# Altium project Palletto_PCB.PrjPcb
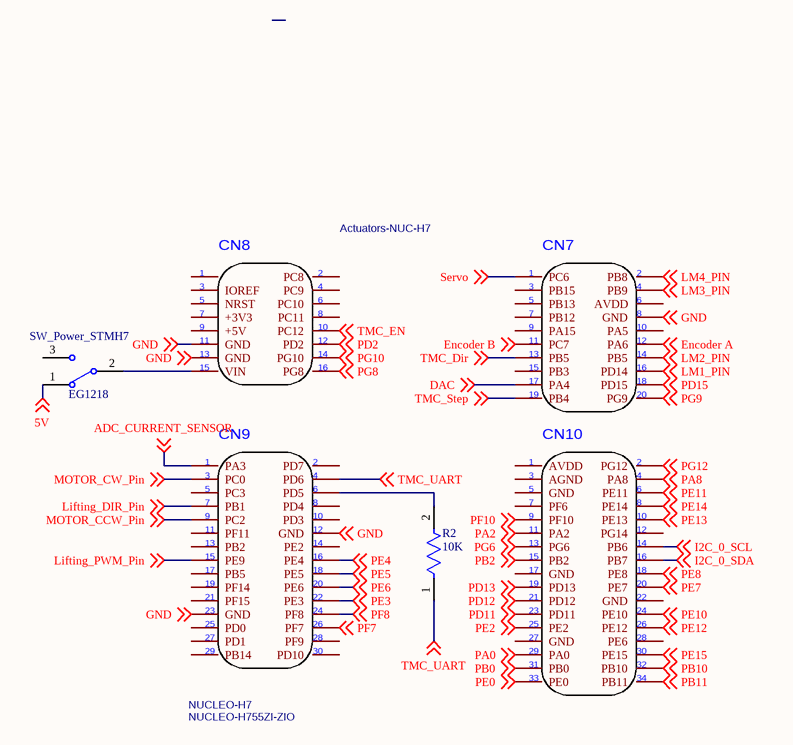
[diagram p0: STM32H755_Breakout_Schematic.SchDoc]
3 sheets, 77 parts. Net scope: flat (ports and power ports of the same name join across sheets).
Board files: Palletto_PCB.PcbDoc, Palletto_V2.PcbDoc
Sheets:
  STM32H755_Breakout_Schematic.SchDoc
  Actuators_Schematic.SchDoc
  Sensors_Schematic.SchDoc

## Sheet STM32H755_Breakout_Schematic.SchDoc
size A; SheetNumber: 1; SheetTotal: 3

### Parts
Actuators-NUC-H7  NUCLEO-H755ZI-ZIO  [NUCLEO-H7]
R2  10K  [FP-MFR-12-MFG]
SW_Power_STMH7  EG1218  [ESWI-EG1218_V]

### Nets
5V: SW_Power_STMH7.1 ; off-sheet 5V
ADC_CURRENT_SENSOR: Actuators-NUC-H7.161(PA3) ; off-sheet ADC_CURRENT_SENSOR
DAC: Actuators-NUC-H7.207(PA4) ; off-sheet DAC
Encoder A: Actuators-NUC-H7.202(PA6) ; off-sheet Encoder A
Encoder B: Actuators-NUC-H7.201(PC7) ; off-sheet Encoder B
GND: Actuators-NUC-H7.155(GND) Actuators-NUC-H7.157(GND) Actuators-NUC-H7.172(GND) Actuators-NUC-H7.183(GND) Actuators-NUC-H7.198(GND) ; off-sheet GND
I2C_0_SCL: Actuators-NUC-H7.224(PB6) ; off-sheet I2C_0_SCL
I2C_0_SDA: Actuators-NUC-H7.226(PB7) ; off-sheet I2C_0_SDA
Lifting_DIR_Pin: Actuators-NUC-H7.167(PB1) ; off-sheet Lifting_DIR_Pin
Lifting_PWM_Pin: Actuators-NUC-H7.175(PE9) ; off-sheet Lifting_PWM_Pin
LM1_PIN: Actuators-NUC-H7.206(PD14) ; off-sheet LM1_PIN
LM2_PIN: Actuators-NUC-H7.204(PB5) ; off-sheet LM2_PIN
LM3_PIN: Actuators-NUC-H7.194(PB9) ; off-sheet LM3_PIN
LM4_PIN: Actuators-NUC-H7.192(PB8) ; off-sheet LM4_PIN
MOTOR_CCW_Pin: Actuators-NUC-H7.169(PC2) ; off-sheet MOTOR_CCW_Pin
MOTOR_CW_Pin: Actuators-NUC-H7.163(PC0) ; off-sheet MOTOR_CW_Pin
PA0: Actuators-NUC-H7.239(PA0) ; off-sheet PA0
PA2: Actuators-NUC-H7.221(PA2) ; off-sheet PA2
PA8: Actuators-NUC-H7.214(PA8) ; off-sheet PA8
PB0: Actuators-NUC-H7.241(PB0) ; off-sheet PB0
PB2: Actuators-NUC-H7.225(PB2) ; off-sheet PB2
PB10: Actuators-NUC-H7.242(PB10) ; off-sheet PB10
PB11: Actuators-NUC-H7.244(PB11) ; off-sheet PB11
PD2: Actuators-NUC-H7.156(PD2) ; off-sheet PD2
PD11: Actuators-NUC-H7.233(PD11) ; off-sheet PD11
PD12: Actuators-NUC-H7.231(PD12) ; off-sheet PD12
PD13: Actuators-NUC-H7.229(PD13) ; off-sheet PD13
PD15: Actuators-NUC-H7.208(PD15) ; off-sheet PD15
PE0: Actuators-NUC-H7.243(PE0) ; off-sheet PE0
PE2: Actuators-NUC-H7.235(PE2) ; off-sheet PE2
PE3: Actuators-NUC-H7.182(PE3) ; off-sheet PE3
PE4: Actuators-NUC-H7.176(PE4) ; off-sheet PE4
PE5: Actuators-NUC-H7.178(PE5) ; off-sheet PE5
PE6: Actuators-NUC-H7.180(PE6) ; off-sheet PE6
PE7: Actuators-NUC-H7.230(PE7) ; off-sheet PE7
PE8: Actuators-NUC-H7.228(PE8) ; off-sheet PE8
PE10: Actuators-NUC-H7.234(PE10) ; off-sheet PE10
PE11: Actuators-NUC-H7.216(PE11) ; off-sheet PE11
PE12: Actuators-NUC-H7.236(PE12) ; off-sheet PE12
PE13: Actuators-NUC-H7.220(PE13) ; off-sheet PE13
PE14: Actuators-NUC-H7.218(PE14) ; off-sheet PE14
PE15: Actuators-NUC-H7.240(PE15) ; off-sheet PE15
PF7: Actuators-NUC-H7.186(PF7) ; off-sheet PF7
PF8: Actuators-NUC-H7.184(PF8) ; off-sheet PF8
PF10: Actuators-NUC-H7.219(PF10) ; off-sheet PF10
PG6: Actuators-NUC-H7.223(PG6) ; off-sheet PG6
PG8: Actuators-NUC-H7.160(PG8) ; off-sheet PG8
PG9: Actuators-NUC-H7.210(PG9) ; off-sheet PG9
PG10: Actuators-NUC-H7.158(PG10) ; off-sheet PG10
PG12: Actuators-NUC-H7.212(PG12) ; off-sheet PG12
Servo: Actuators-NUC-H7.191(PC6) ; off-sheet Servo
TMC_Dir: Actuators-NUC-H7.203(PB5) ; off-sheet TMC_Dir
TMC_EN: Actuators-NUC-H7.154(PC12) ; off-sheet TMC_EN
TMC_Step: Actuators-NUC-H7.209(PB4) ; off-sheet TMC_Step
TMC_UART: Actuators-NUC-H7.164(PD6) R2.1 ; off-sheet TMC_UART
NetActuators-NUC-H7_159: Actuators-NUC-H7.159(VIN) SW_Power_STMH7.2(COM)
NetActuators-NUC-H7_166: Actuators-NUC-H7.166(PD5) R2.2

Not connected (* = marked no-connect by the designer): Actuators-NUC-H7 145(PC10) 146(PC8) 147(IOREF) 148(PC9) 149(NRST) 150(PC10) 151(+3V3) 152(PC11) 153(+5V) 162(PD7) 165(PC3) 168(PD4) 170(PD3) 171(PF11) 173(PB2) 174(PE2) 177(PB5) 179(PF14) 181(PF15) 185(PD0) 187(PD1) 188(PF9) 189(PB14) 190(PD10) 193(PB15) 195(PB13) 196(AVDD) 197(PB12) 199(PA15) 200(PA5) 205(PB3) 211(AVDD) 213(AGND) 215(GND) 217(PF6) 222(PG14) 227(GND) 232(GND) 237(GND) 238(PE6); SW_Power_STMH7 3

### Notes on the sheet
- (in symbol NUCLEO-H755ZI-ZIO) CN8; CN7; 1; 2; 3; 4; 5; 6; 7; 8; 9; 10; 11; 12; 13; 14; 15; 16; 17; 18; 19; 20; CN9; CN10; 21; 22; 23; 24; 25; 26; 27; 28; 29; 30; 31; 32; 33; 34; NUCLEO-H7

### Library data of the parts
Actuators-NUC-H7 = NUCLEO-H755ZI-ZIO: Contributor: zutawin; Package Display: Yes; spicePre: X; Mounted: Yes; Supplier Part: 100x; Supplier: DOLI; spiceSymbolName: NUCLEO-H755ZI-ZIO
R2 = CMP-03413-000012-1: RES MF 1/6W 1% AXIAL; Power Rating: 160mW; Voltage Rating (DC): 200V; Resistance: 10kR; Min Operating Temperature: -55°C; Max Operating Temperature: 155°C; Voltage Rating: 200V; Termination: Axial; Packaging: Ammo Pack; Tolerance: 1%
SW_Power_STMH7 = CMP-1696-00002-1: Slide Switch, 500 V, -20 to 70 degC, 3-Pin THD, RoHS; Case\Package: SOT-23-5; Output Current: 150 mA; Nominal Output Voltage: 3.3 V; Max Power Dissipation: 250 mW; Min Input Voltage: 4.3 V; Outputs: 1; Max Input Voltage: 8 V; Dropout Voltage: 300 mV; PackageDescription: 3-Pin Through Hole Device, Body 11.6 x 4 mm, Pitch 2.5 mm; ComponentLink1URL: http://www.e-switch.ch/en/; RoHSCompliant: true; Length: 3 mm; ComponentLink1Description: Manufacturer URL; Power Rating: 250 mW; Mount: Surface Mount; Max Operating Temperature: 85 degC; REACH SVHC: No SVHC; Radiation Hardening: No; Height: 1.3 mm; Pins: 5; Max Ouput Current: 150 mA; Output Voltage: 3.3 V; Width: 1.8 mm; Package Quantity: 3000; ComponentLink2URL: https://www.e-switch.com/system/asset/product_line/data_sheet/119/EG.pdf; Min Operating Temperature: -40 degC; ComponentLink2Description: Datasheet; DatasheetVersion: Oct-15; PackageReference: EG1218; Packaging: Tape and Reel

## Sheet Actuators_Schematic.SchDoc
size A; SheetNumber: 2; SheetTotal: 3
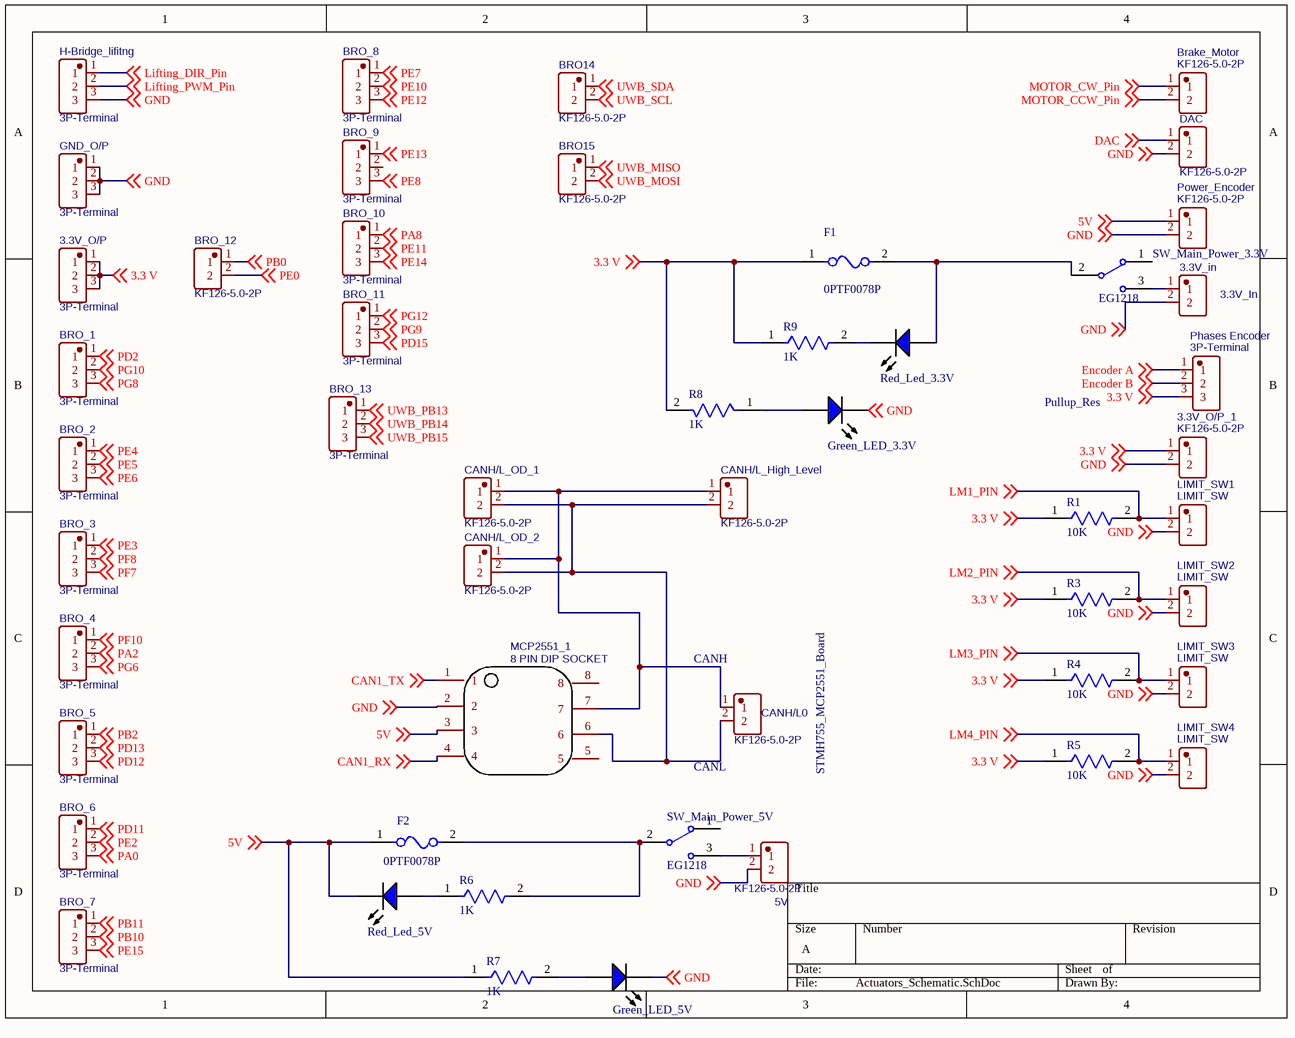
[diagram p1: Actuators_Schematic.SchDoc]

### Parts
3.3V_in  3.3V_In  [CONN-TH_P5.00_KF126-5.0-2P]
3.3V_O/P  3P-Terminal  [CONN-TH_3P-P5.00_KF126-5.0-3P]
3.3V_O/P_1  KF126-5.0-2P  [CONN-TH_P5.00_KF126-5.0-2P]
5V  KF126-5.0-2P  [CONN-TH_P5.00_KF126-5.0-2P]
Brake_Motor  KF126-5.0-2P  [CONN-TH_P5.00_KF126-5.0-2P]
BRO14  KF126-5.0-2P  [CONN-TH_P5.00_KF126-5.0-2P]
BRO15  KF126-5.0-2P  [CONN-TH_P5.00_KF126-5.0-2P]
BRO_1  3P-Terminal  [CONN-TH_3P-P5.00_KF126-5.0-3P]
BRO_2  3P-Terminal  [CONN-TH_3P-P5.00_KF126-5.0-3P]
BRO_3  3P-Terminal  [CONN-TH_3P-P5.00_KF126-5.0-3P]
BRO_4  3P-Terminal  [CONN-TH_3P-P5.00_KF126-5.0-3P]
BRO_5  3P-Terminal  [CONN-TH_3P-P5.00_KF126-5.0-3P]
BRO_6  3P-Terminal  [CONN-TH_3P-P5.00_KF126-5.0-3P]
BRO_7  3P-Terminal  [CONN-TH_3P-P5.00_KF126-5.0-3P]
BRO_8  3P-Terminal  [CONN-TH_3P-P5.00_KF126-5.0-3P]
BRO_9  3P-Terminal  [CONN-TH_3P-P5.00_KF126-5.0-3P]
BRO_10  3P-Terminal  [CONN-TH_3P-P5.00_KF126-5.0-3P]
BRO_11  3P-Terminal  [CONN-TH_3P-P5.00_KF126-5.0-3P]
BRO_12  KF126-5.0-2P  [CONN-TH_P5.00_KF126-5.0-2P]
BRO_13  3P-Terminal  [CONN-TH_3P-P5.00_KF126-5.0-3P]
CANH/L0  KF126-5.0-2P  [CONN-TH_P5.00_KF126-5.0-2P]
CANH/L_High_Level  KF126-5.0-2P  [CONN-TH_P5.00_KF126-5.0-2P]
CANH/L_OD_1  KF126-5.0-2P  [CONN-TH_P5.00_KF126-5.0-2P]
CANH/L_OD_2  KF126-5.0-2P  [CONN-TH_P5.00_KF126-5.0-2P]
DAC  KF126-5.0-2P  [CONN-TH_P5.00_KF126-5.0-2P]
F1  0PTF0078P  [FP-0PTF0078P-MFG]
F2  0PTF0078P  [FP-0PTF0078P-MFG]
GND_O/P  3P-Terminal  [CONN-TH_3P-P5.00_KF126-5.0-3P]
Green_LED_3.3V  WP710A10QBC/D  [KING-WP710A10QBCD_V]  (value not drawn)
Green_LED_5V  WP710A10QBC/D  [KING-WP710A10QBCD_V]  (value not drawn)
H-Bridge_lifitng  3P-Terminal  [CONN-TH_3P-P5.00_KF126-5.0-3P]
LIMIT_SW1  LIMIT_SW  [CONN-TH_P5.00_KF126-5.0-2P]
LIMIT_SW2  LIMIT_SW  [CONN-TH_P5.00_KF126-5.0-2P]
LIMIT_SW3  LIMIT_SW  [CONN-TH_P5.00_KF126-5.0-2P]
LIMIT_SW4  LIMIT_SW  [CONN-TH_P5.00_KF126-5.0-2P]
MCP2551_1  8 PIN DIP SOCKET  [DIP 8 PIN SOCKET]
Phases_Encoder  3P-Terminal  [CONN-TH_3P-P5.00_KF126-5.0-3P]
Power_Encoder  KF126-5.0-2P  [CONN-TH_P5.00_KF126-5.0-2P]
R1  10K  [FP-MFR-12-MFG]
R3  10K  [FP-MFR-12-MFG]
R4  10K  [FP-MFR-12-MFG]
R5  10K  [FP-MFR-12-MFG]
R6  1K  [FP-MFR-12-MFG]
R7  1K  [FP-MFR-12-MFG]
R8  1K  [FP-MFR-12-MFG]
R9  1K  [FP-MFR-12-MFG]
Red_Led_3.3V  WP710A10QBC/D  [KING-WP710A10QBCD_V]  (value not drawn)
Red_Led_5V  WP710A10QBC/D  [KING-WP710A10QBCD_V]  (value not drawn)
SW_Main_Power_3.3V  EG1218  [ESWI-EG1218_V]
SW_Main_Power_5V  EG1218  [ESWI-EG1218_V]

### Nets
3.3 V: 3.3V_O/P.1 3.3V_O/P.2 3.3V_O/P.3 3.3V_O/P_1.1 F1.1 Phases_Encoder.3 R1.1 R3.1 R4.1 R5.1 R8.2 R9.1 ; off-sheet 3.3 V
5V: F2.1 MCP2551_1.3 Power_Encoder.1 R7.1 Red_Led_5V.2(K) ; off-sheet 5V
CAN1_RX: MCP2551_1.4 ; off-sheet CAN1_RX
CAN1_TX: MCP2551_1.1 ; off-sheet CAN1_TX
DAC: DAC.1 ; off-sheet DAC
Encoder A: Phases_Encoder.1 ; off-sheet Encoder A
Encoder B: Phases_Encoder.2 ; off-sheet Encoder B
GND: 3.3V_in.2 3.3V_O/P_1.2 5V.2 DAC.2 GND_O/P.1 GND_O/P.2 GND_O/P.3 Green_LED_3.3V.2(K) Green_LED_5V.2(K) H-Bridge_lifitng.3 LIMIT_SW1.2 LIMIT_SW2.2 LIMIT_SW3.2 LIMIT_SW4.2 MCP2551_1.2 Power_Encoder.2 ; off-sheet GND
Lifting_DIR_Pin: H-Bridge_lifitng.1 ; off-sheet Lifting_DIR_Pin
Lifting_PWM_Pin: H-Bridge_lifitng.2 ; off-sheet Lifting_PWM_Pin
LM1_PIN: LIMIT_SW1.1 R1.2 ; off-sheet LM1_PIN
LM2_PIN: LIMIT_SW2.1 R3.2 ; off-sheet LM2_PIN
LM3_PIN: LIMIT_SW3.1 R4.2 ; off-sheet LM3_PIN
LM4_PIN: LIMIT_SW4.1 R5.2 ; off-sheet LM4_PIN
MOTOR_CCW_Pin: Brake_Motor.2 ; off-sheet MOTOR_CCW_Pin
MOTOR_CW_Pin: Brake_Motor.1 ; off-sheet MOTOR_CW_Pin
PA0: BRO_6.3 ; off-sheet PA0
PA2: BRO_4.2 ; off-sheet PA2
PA8: BRO_10.1 ; off-sheet PA8
PB0: BRO_12.1 ; off-sheet PB0
PB2: BRO_5.1 ; off-sheet PB2
PB10: BRO_7.2 ; off-sheet PB10
PB11: BRO_7.1 ; off-sheet PB11
PD2: BRO_1.1 ; off-sheet PD2
PD11: BRO_6.1 ; off-sheet PD11
PD12: BRO_5.3 ; off-sheet PD12
PD13: BRO_5.2 ; off-sheet PD13
PD15: BRO_11.3 ; off-sheet PD15
PE0: BRO_12.2 ; off-sheet PE0
PE2: BRO_6.2 ; off-sheet PE2
PE3: BRO_3.1 ; off-sheet PE3
PE4: BRO_2.1 ; off-sheet PE4
PE5: BRO_2.2 ; off-sheet PE5
PE6: BRO_2.3 ; off-sheet PE6
PE7: BRO_8.1 ; off-sheet PE7
PE8: BRO_9.3 ; off-sheet PE8
PE10: BRO_8.2 ; off-sheet PE10
PE11: BRO_10.2 ; off-sheet PE11
PE12: BRO_8.3 ; off-sheet PE12
PE13: BRO_9.1 ; off-sheet PE13
PE14: BRO_10.3 ; off-sheet PE14
PE15: BRO_7.3 ; off-sheet PE15
PF7: BRO_3.3 ; off-sheet PF7
PF8: BRO_3.2 ; off-sheet PF8
PF10: BRO_4.1 ; off-sheet PF10
PG6: BRO_4.3 ; off-sheet PG6
PG8: BRO_1.3 ; off-sheet PG8
PG9: BRO_11.2 ; off-sheet PG9
PG10: BRO_1.2 ; off-sheet PG10
PG12: BRO_11.1 ; off-sheet PG12
UWB_MISO: BRO15.1 ; off-sheet UWB_MISO
UWB_MOSI: BRO15.2 ; off-sheet UWB_MOSI
UWB_PB13: BRO_13.1 ; off-sheet UWB_PB13
UWB_PB14: BRO_13.2 ; off-sheet UWB_PB14
UWB_PB15: BRO_13.3 ; off-sheet UWB_PB15
UWB_SCL: BRO14.2 ; off-sheet UWB_SCL
UWB_SDA: BRO14.1 ; off-sheet UWB_SDA
Net3.3V_in_1: 3.3V_in.1 SW_Main_Power_3.3V.3
Net5V_1: 5V.1 SW_Main_Power_5V.3
NetCANH/L0_1: CANH/L0.1 CANH/L_High_Level.1 CANH/L_OD_1.1 CANH/L_OD_2.1 MCP2551_1.7
NetCANH/L0_2: CANH/L0.2 CANH/L_High_Level.2 CANH/L_OD_1.2 CANH/L_OD_2.2 MCP2551_1.6
NetF1_2: F1.2 Red_Led_3.3V.1(A) SW_Main_Power_3.3V.2(COM)
NetF2_2: F2.2 R6.2 SW_Main_Power_5V.2(COM)
NetGreen_LED_3.3V_1: Green_LED_3.3V.1(A) R8.1
NetGreen_LED_5V_1: Green_LED_5V.1(A) R7.2
NetR6_1: R6.1 Red_Led_5V.1(A)
NetR9_2: R9.2 Red_Led_3.3V.2(K)

Not connected (* = marked no-connect by the designer): BRO_9 2; MCP2551_1 5 8; SW_Main_Power_3.3V 1; SW_Main_Power_5V 1

### Notes on the sheet
- Pullup_Res
- (near CANH/L0) CANH
- CANL
- STMH755_MCP2551_Board

### Library data of the parts
3.3V_in 3.3V_O/P_1 5V Brake_Motor BRO14 BRO15 BRO_12 CANH/L0 CANH/L_High_Level CANH/L_OD_1 CANH/L_OD_2 DAC LIMIT_SW1-LIMIT_SW4 Power_Encoder = KF126-5.0-2P: Manufacturer: Cixi Kefa Elec; Contributor: LCSC; Supplier: LCSC; Supplier Part: C474900; Manufacturer Part: KF126-5.0-2P; spicePre: P; spiceSymbolName: KF126-5.0-2P
3.3V_O/P BRO_1-BRO_11 BRO_13 GND_O/P H-Bridge_lifitng Phases_Encoder = Limit Switch: Manufacturer: Cixi Kefa Elec; Manufacturer Part: KF126-5.0-3P; Contributor: thulasikrishna; Supplier: LCSC; Supplier Part: C474901; JLCPCB Part Class: Extended Part; spicePre: U; spiceSymbolName: KF126-5.0-3P
F1 F2 = CMP-08604-000023-1: FUSE BLOCK CARTRIDGE PCB; Manufacturer: Littelfuse Inc; Number Of Fuses: 1; Conn Orientation: Vertical; Fuse Current: 6.3A; Voltage Rating Ac: 250V; Package: 0; Ambient Temperature Range Low: -30°C; ComponentLink2URL: https://media.digikey.com/pdf/Data%20Sheets/Littelfuse%20PDFs/PTF075_77_78.pdf; Device Class L3: unset; Lead Free: Yes; Device Class L1: Circuit Protection; RoHS: TRUE; Manufacturer Part Number: 0PTF0078P; Ambient Temperature Range High: +85°C; Category: Fuse; Octopart: https://octopart.com/0ptf0078p-littelfuse-13255855; Digikey Description: FUSE BLOCK CARTRIDGE PCB; Height: 11.5mm; ComponentLink2Description: Datasheet; Device Class L2: Fuse Holders; Mouser Description: Fuse Holder 5X20MM Pitch 22/7 UL94V0 Open; Automotive: No; Voltage Rating Dc: 250V
Green_LED_3.3V Green_LED_5V Red_Led_3.3V Red_Led_5V = CMP-2000-07416-1: Blue LED, 3.3 V, 20 mA, -40 to 85 degC, 2-Pin THD, RoHS, Bulk; Manufacturer: Kingbright; Forward Current: 20mA; LED Size: T-1; Viewing Angle: 20deg; Lens Color/Style: WaterClear; Wavelength/Color Temperature: 470nm; Forward Voltage: 3.3V; Luminous Intensity: 1600mcd; Lens Shape: Dome; Minimum Operating Temperature: -40C; Package Description: 2-Pin Through Hole Device, Dia 3.2 mm; Packaging: Bulk; Maximum Operating Temperature: +85C; Factory Pack Quantity: 500; Mounting Technology: ThroughHole; Datasheet URL: https://datasheet.ciiva.com/2121/wp710a10qbc-d-2121617.pdf; Datasheet Version: Rev. 5B, 09/2014; Type: SolidStateLEDLamp; Package Reference: WP710A10QBCD; Lens Dimensions: 3mmx4.6mm; Product Category: StandardLEDs-ThroughHole; Manufacturer URL: http://www.kingbright.com/; Mounting Style: ThroughHole; RoHS: Details; Illumination Color: Blue
MCP2551_1 = 8 PIN DIP SOCKET: Contributor: uniqengineeringworks; Supplier: LCSC; spicePre: U; spiceSymbolName: 8 PIN DIP SOCKET
R1 R3-R9 = CMP-03413-000012-1: as R2 on sheet STM32H755_Breakout_Schematic; Min Operating Temperature: -55°C; Max Operating Temperature: 155°C; Voltage Rating: 200V; Termination: Axial; Packaging: Ammo Pack; Tolerance: 1%
SW_Main_Power_3.3V SW_Main_Power_5V = CMP-1696-00002-1: as SW_Power_STMH7 on sheet STM32H755_Breakout_Schematic; PackageDescription: 3-Pin Through Hole Device, Body 11.6 x 4 mm, Pitch 2.5 mm; ComponentLink1URL: http://www.e-switch.ch/en/; RoHSCompliant: true; Length: 3 mm; ComponentLink1Description: Manufacturer URL; Power Rating: 250 mW; Mount: Surface Mount; Max Operating Temperature: 85 degC; REACH SVHC: No SVHC; Radiation Hardening: No; Height: 1.3 mm; Pins: 5; Max Ouput Current: 150 mA; Output Voltage: 3.3 V; Width: 1.8 mm; Package Quantity: 3000; ComponentLink2URL: https://www.e-switch.com/system/asset/product_line/data_sheet/119/EG.pdf; Min Operating Temperature: -40 degC; ComponentLink2Description: Datasheet; DatasheetVersion: Oct-15; PackageReference: EG1218; Packaging: Tape and Reel

## Sheet Sensors_Schematic.SchDoc
size A; SheetNumber: 3; SheetTotal: 3
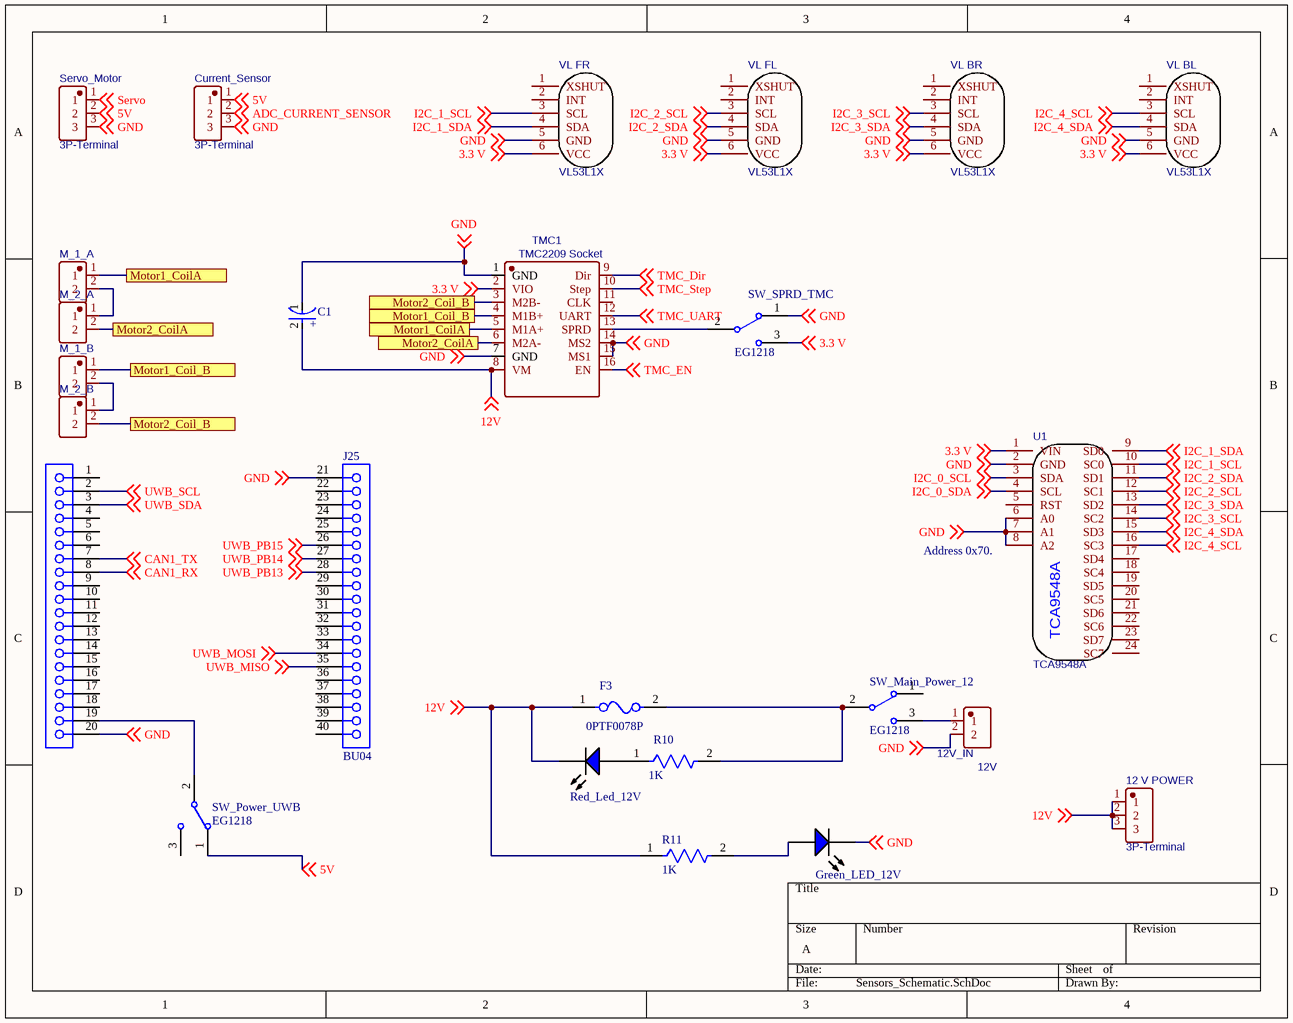
[diagram p2: Sensors_Schematic.SchDoc]

### Parts
12_V_POWER  3P-Terminal  [CONN-TH_3P-P5.00_KF126-5.0-3P]
12V  12V_IN  [CONN-TH_P5.00_KF126-5.0-2P]
C1  EEUFM1E101B  [FP-RAD-TH-D_6_3_0_5-L_11-MFG]  (value not drawn)
Current_Sensor  3P-Terminal  [CONN-TH_3P-P5.00_KF126-5.0-3P]
F3  0PTF0078P  [FP-0PTF0078P-MFG]
Green_LED_12V  WP710A10QBC/D  [KING-WP710A10QBCD_V]  (value not drawn)
J25  BU04  [BU04_KIT_N]
M_1_A  (no value)  [CONN-TH_P5.00_KF126-5.0-2P]
M_1_B  (no value)  [CONN-TH_P5.00_KF126-5.0-2P]
M_2_A  (no value)  [CONN-TH_P5.00_KF126-5.0-2P]
M_2_B  (no value)  [CONN-TH_P5.00_KF126-5.0-2P]
R10  1K  [FP-MFR-12-MFG]
R11  1K  [FP-MFR-12-MFG]
Red_Led_12V  WP710A10QBC/D  [KING-WP710A10QBCD_V]  (value not drawn)
Servo_Motor  3P-Terminal  [CONN-TH_3P-P5.00_KF126-5.0-3P]
SW_Main_Power_12  EG1218  [ESWI-EG1218_V]
SW_Power_UWB  EG1218  [ESWI-EG1218_V]
SW_SPRD_TMC  EG1218  [ESWI-EG1218_V]
TMC1  TMC2209 Socket  [COMM-TH_TMC2209SILENTSTEPSTICK]
U1  TCA9548A  [TCA9548A]
VL_BL  VL53L1X  [VL53L1X_BREAKOUT]
VL_BR  VL53L1X  [VL53L1X_BREAKOUT]
VL_FL  VL53L1X  [VL53L1X_BREAKOUT]
VL_FR  VL53L1X  [VL53L1X_BREAKOUT]

### Ports
Motor1_Coil_B (see Sensors_Schematic[1B]), Motor1_Coil_B (see Sensors_Schematic[2B]), Motor1_CoilA (see Sensors_Schematic[1B]), Motor1_CoilA (see Sensors_Schematic[2B]), Motor2_Coil_B (see Sensors_Schematic[1B]), Motor2_Coil_B (see Sensors_Schematic[2B]), Motor2_CoilA (see Sensors_Schematic[1B]), Motor2_CoilA (see Sensors_Schematic[2B])

### Nets
3.3 V: SW_SPRD_TMC.3 TMC1.2(VIO) U1.1(VIN) VL_BL.6(VCC) VL_BR.6(VCC) VL_FL.6(VCC) VL_FR.6(VCC) ; off-sheet 3.3 V
5V: Current_Sensor.1 Servo_Motor.2 SW_Power_UWB.1 ; off-sheet 5V
12V: 12_V_POWER.1 12_V_POWER.2 12_V_POWER.3 C1.2(A) F3.1 R11.1 Red_Led_12V.2(K) TMC1.8(VM) ; off-sheet 12V
ADC_CURRENT_SENSOR: Current_Sensor.2 ; off-sheet ADC_CURRENT_SENSOR
CAN1_RX: J25.8 ; off-sheet CAN1_RX
CAN1_TX: J25.7 ; off-sheet CAN1_TX
GND: 12V.2 C1.1(C) Current_Sensor.3 Green_LED_12V.2(K) J25.20 J25.21 Servo_Motor.3 SW_SPRD_TMC.1 TMC1.1(GND) TMC1.7(GND) TMC1.14(MS2) TMC1.15(MS1) U1.2(GND) U1.6(A0) U1.7(A1) U1.8(A2) VL_BL.5(GND) VL_BR.5(GND) VL_FL.5(GND) VL_FR.5(GND) ; off-sheet GND
I2C_0_SCL: U1.3(SDA) ; off-sheet I2C_0_SCL
I2C_0_SDA: U1.4(SCL) ; off-sheet I2C_0_SDA
I2C_1_SCL: U1.10(SC0) VL_FR.3(SCL) ; off-sheet I2C_1_SCL
I2C_1_SDA: U1.9(SD0) VL_FR.4(SDA) ; off-sheet I2C_1_SDA
I2C_2_SCL: U1.12(SC1) VL_FL.3(SCL) ; off-sheet I2C_2_SCL
I2C_2_SDA: U1.11(SD1) VL_FL.4(SDA) ; off-sheet I2C_2_SDA
I2C_3_SCL: U1.14(SC2) VL_BR.3(SCL) ; off-sheet I2C_3_SCL
I2C_3_SDA: U1.13(SD2) VL_BR.4(SDA) ; off-sheet I2C_3_SDA
I2C_4_SCL: U1.16(SC3) VL_BL.3(SCL) ; off-sheet I2C_4_SCL
I2C_4_SDA: U1.15(SD3) VL_BL.4(SDA) ; off-sheet I2C_4_SDA
Servo: Servo_Motor.1 ; off-sheet Servo
TMC_Dir: TMC1.9(Dir) ; off-sheet TMC_Dir
TMC_EN: TMC1.16(EN) ; off-sheet TMC_EN
TMC_Step: TMC1.10(Step) ; off-sheet TMC_Step
TMC_UART: TMC1.12(UART) ; off-sheet TMC_UART
UWB_MISO: J25.35 ; off-sheet UWB_MISO
UWB_MOSI: J25.34 ; off-sheet UWB_MOSI
UWB_PB13: J25.28 ; off-sheet UWB_PB13
UWB_PB14: J25.27 ; off-sheet UWB_PB14
UWB_PB15: J25.26 ; off-sheet UWB_PB15
UWB_SCL: J25.2 ; off-sheet UWB_SCL
UWB_SDA: J25.3 ; off-sheet UWB_SDA
Net12V_1: 12V.1 SW_Main_Power_12.3
NetF3_2: F3.2 R10.2 SW_Main_Power_12.2(COM)
NetGreen_LED_12V_1: Green_LED_12V.1(A) R11.2
NetJ25_19: J25.19 SW_Power_UWB.2(COM)
NetM_1_A_1: M_1_A.1 TMC1.5(M1A+) ; port Motor1_CoilA
NetM_1_A_2: M_1_A.2 M_2_A.1
NetM_1_B_1: M_1_B.1 TMC1.4(M1B+) ; port Motor1_Coil_B
NetM_1_B_2: M_1_B.2 M_2_B.1
NetM_2_A_2: M_2_A.2 TMC1.6(M2A-) ; port Motor2_CoilA
NetM_2_B_2: M_2_B.2 TMC1.3(M2B-) ; port Motor2_Coil_B
NetR10_1: R10.1 Red_Led_12V.1(A)
NetSW_SPRD_TMC_2: SW_SPRD_TMC.2(COM) TMC1.13(SPRD)

Not connected (* = marked no-connect by the designer): J25 1 4 5 6 9 10 11 12 13 14 15 16 17 18 22 23 24 25 29 30 31 32 33 36 37 38 39 40; SW_Main_Power_12 1; SW_Power_UWB 3; TMC1 11(CLK); U1 5(RST) 17(SD4) 18(SC4) 19(SD5) 20(SC5) 21(SD6) 22(SC6) 23(SD7) 24(SC7); VL_BL 1(XSHUT) 2(INT); VL_BR 1(XSHUT) 2(INT); VL_FL 1(XSHUT) 2(INT); VL_FR 1(XSHUT) 2(INT)

### Notes on the sheet
- (near U1) Address 0x70.
- (in symbol CMP-05427-000856-1) +

### Library data of the parts
12_V_POWER Current_Sensor Servo_Motor = Limit Switch: as 3.3V_O/P on sheet Actuators_Schematic; Supplier: LCSC; Supplier Part: C474901; JLCPCB Part Class: Extended Part; spicePre: U; spiceSymbolName: KF126-5.0-3P
12V M_1_A M_1_B M_2_A M_2_B = KF126-5.0-2P: as 3.3V_in on sheet Actuators_Schematic; Supplier: LCSC; Supplier Part: C474900; Manufacturer Part: KF126-5.0-2P; spicePre: P; spiceSymbolName: KF126-5.0-2P
C1 = CMP-05427-000856-1: Aluminum Electrolytic Capacitors (Radial Lead Type) 100uF ±20% 25V; Lead Diameter: 0.5mm; Polarity: Polar; Ripple Current: 455mA; Impedance: 130mR; Life (Hours): 2000Hour; Length: 11mm; Min Operating Temperature: -40°C; Termination: Radial; Diameter: 6mm; Lead Pitch: 5mm; Tolerance: 20%; Capacitance: 100uF; Case/Package: Radial; Voltage Rating (DC): 25V; Height - Seated (Max): 0.5inch; RoHS Compliant: Yes; Series: FM; Package Quantity: 2000; Voltage Rating: 25V; Max Operating Temperature: 105°C; Mount: Through Hole; ESR (Equivalent Series Resistance): 130mR; Packaging: Tape and Reel
F3 = CMP-08604-000023-1: as F1 on sheet Actuators_Schematic; Package: 0; Ambient Temperature Range Low: -30°C; ComponentLink2URL: https://media.digikey.com/pdf/Data%20Sheets/Littelfuse%20PDFs/PTF075_77_78.pdf; Device Class L3: unset; Lead Free: Yes; Device Class L1: Circuit Protection; RoHS: TRUE; Manufacturer Part Number: 0PTF0078P; Ambient Temperature Range High: +85°C; Category: Fuse; Octopart: https://octopart.com/0ptf0078p-littelfuse-13255855; Digikey Description: FUSE BLOCK CARTRIDGE PCB; Height: 11.5mm; ComponentLink2Description: Datasheet; Device Class L2: Fuse Holders; Mouser Description: Fuse Holder 5X20MM Pitch 22/7 UL94V0 Open; Automotive: No; Voltage Rating Dc: 250V
Green_LED_12V Red_Led_12V = CMP-2000-07416-1: as Green_LED_3.3V on sheet Actuators_Schematic; Minimum Operating Temperature: -40C; Package Description: 2-Pin Through Hole Device, Dia 3.2 mm; Packaging: Bulk; Maximum Operating Temperature: +85C; Factory Pack Quantity: 500; Mounting Technology: ThroughHole; Datasheet URL: https://datasheet.ciiva.com/2121/wp710a10qbc-d-2121617.pdf; Datasheet Version: Rev. 5B, 09/2014; Type: SolidStateLEDLamp; Package Reference: WP710A10QBCD; Lens Dimensions: 3mmx4.6mm; Product Category: StandardLEDs-ThroughHole; Manufacturer URL: http://www.kingbright.com/; Mounting Style: ThroughHole; RoHS: Details; Illumination Color: Blue
J25 = BU04: BU04_KIT; Contact Resistance: 20mΩ; Gender: Female; Current Rating: 3A; Operating Supply Voltage: 250V; Lead Pitch: 2.54mm; Number of Pins: 40; Orientation: Vertical
R10 R11 = CMP-03413-000012-1: as R2 on sheet STM32H755_Breakout_Schematic; Min Operating Temperature: -55°C; Max Operating Temperature: 155°C; Voltage Rating: 200V; Termination: Axial; Packaging: Ammo Pack; Tolerance: 1%
SW_Main_Power_12 SW_Power_UWB SW_SPRD_TMC = CMP-1696-00002-1: as SW_Power_STMH7 on sheet STM32H755_Breakout_Schematic; PackageDescription: 3-Pin Through Hole Device, Body 11.6 x 4 mm, Pitch 2.5 mm; ComponentLink1URL: http://www.e-switch.ch/en/; RoHSCompliant: true; Length: 3 mm; ComponentLink1Description: Manufacturer URL; Power Rating: 250 mW; Mount: Surface Mount; Max Operating Temperature: 85 degC; REACH SVHC: No SVHC; Radiation Hardening: No; Height: 1.3 mm; Pins: 5; Max Ouput Current: 150 mA; Output Voltage: 3.3 V; Width: 1.8 mm; Package Quantity: 3000; ComponentLink2URL: https://www.e-switch.com/system/asset/product_line/data_sheet/119/EG.pdf; Min Operating Temperature: -40 degC; ComponentLink2Description: Datasheet; DatasheetVersion: Oct-15; PackageReference: EG1218; Packaging: Tape and Reel
TMC1 = TMC2209 Socket: Manufacturer: TRINAMIC; Contributor: plcis; Supplier: LCSC; Supplier Part: C17375345; Manufacturer Part: TMC2209 Socket; JLCPCB Part Class: Extended Part; spicePre: U; spiceSymbolName: TMC2209 Socket
U1 = TCA9548A: Manufacturer: Texas Instruments; Contributor: Dompie; Manufacturer Part: TCA9548A; Supplier: Adafruit; Supplier Part: 2717; link: https://www.adafruit.com/product/2717; spicePre: U; spiceSymbolName: TCA9548A
VL_BL VL_BR VL_FL VL_FR = VL53L1X_BREAKOUT COPY: Manufacturer Part: VL53L0X Time-of-Flight Distance Sensor VL53L0X; Contributor: freddyka; spicePre: U; spiceSymbolName: VL53L1X_BREAKOUT COPY

## Nets that join several sheets
3.3 V: Actuators_Schematic (12 pins), Sensors_Schematic (7 pins)
5V: STM32H755_Breakout_Schematic (SW_Power_STMH7.1), Actuators_Schematic (5 pins), Sensors_Schematic (Current_Sensor.1 Servo_Motor.2 SW_Power_UWB.1)
ADC_CURRENT_SENSOR: STM32H755_Breakout_Schematic (Actuators-NUC-H7.161), Sensors_Schematic (Current_Sensor.2)
CAN1_RX: Actuators_Schematic (MCP2551_1.4), Sensors_Schematic (J25.8)
CAN1_TX: Actuators_Schematic (MCP2551_1.1), Sensors_Schematic (J25.7)
DAC: STM32H755_Breakout_Schematic (Actuators-NUC-H7.207), Actuators_Schematic (DAC.1)
Encoder A: STM32H755_Breakout_Schematic (Actuators-NUC-H7.202), Actuators_Schematic (Phases_Encoder.1)
Encoder B: STM32H755_Breakout_Schematic (Actuators-NUC-H7.201), Actuators_Schematic (Phases_Encoder.2)
GND: STM32H755_Breakout_Schematic (5 pins), Actuators_Schematic (16 pins), Sensors_Schematic (20 pins)
I2C_0_SCL: STM32H755_Breakout_Schematic (Actuators-NUC-H7.224), Sensors_Schematic (U1.3)
I2C_0_SDA: STM32H755_Breakout_Schematic (Actuators-NUC-H7.226), Sensors_Schematic (U1.4)
Lifting_DIR_Pin: STM32H755_Breakout_Schematic (Actuators-NUC-H7.167), Actuators_Schematic (H-Bridge_lifitng.1)
Lifting_PWM_Pin: STM32H755_Breakout_Schematic (Actuators-NUC-H7.175), Actuators_Schematic (H-Bridge_lifitng.2)
LM1_PIN: STM32H755_Breakout_Schematic (Actuators-NUC-H7.206), Actuators_Schematic (LIMIT_SW1.1 R1.2)
LM2_PIN: STM32H755_Breakout_Schematic (Actuators-NUC-H7.204), Actuators_Schematic (LIMIT_SW2.1 R3.2)
LM3_PIN: STM32H755_Breakout_Schematic (Actuators-NUC-H7.194), Actuators_Schematic (LIMIT_SW3.1 R4.2)
LM4_PIN: STM32H755_Breakout_Schematic (Actuators-NUC-H7.192), Actuators_Schematic (LIMIT_SW4.1 R5.2)
MOTOR_CCW_Pin: STM32H755_Breakout_Schematic (Actuators-NUC-H7.169), Actuators_Schematic (Brake_Motor.2)
MOTOR_CW_Pin: STM32H755_Breakout_Schematic (Actuators-NUC-H7.163), Actuators_Schematic (Brake_Motor.1)
PA0: STM32H755_Breakout_Schematic (Actuators-NUC-H7.239), Actuators_Schematic (BRO_6.3)
PA2: STM32H755_Breakout_Schematic (Actuators-NUC-H7.221), Actuators_Schematic (BRO_4.2)
PA8: STM32H755_Breakout_Schematic (Actuators-NUC-H7.214), Actuators_Schematic (BRO_10.1)
PB0: STM32H755_Breakout_Schematic (Actuators-NUC-H7.241), Actuators_Schematic (BRO_12.1)
PB2: STM32H755_Breakout_Schematic (Actuators-NUC-H7.225), Actuators_Schematic (BRO_5.1)
PB10: STM32H755_Breakout_Schematic (Actuators-NUC-H7.242), Actuators_Schematic (BRO_7.2)
PB11: STM32H755_Breakout_Schematic (Actuators-NUC-H7.244), Actuators_Schematic (BRO_7.1)
PD2: STM32H755_Breakout_Schematic (Actuators-NUC-H7.156), Actuators_Schematic (BRO_1.1)
PD11: STM32H755_Breakout_Schematic (Actuators-NUC-H7.233), Actuators_Schematic (BRO_6.1)
PD12: STM32H755_Breakout_Schematic (Actuators-NUC-H7.231), Actuators_Schematic (BRO_5.3)
PD13: STM32H755_Breakout_Schematic (Actuators-NUC-H7.229), Actuators_Schematic (BRO_5.2)
PD15: STM32H755_Breakout_Schematic (Actuators-NUC-H7.208), Actuators_Schematic (BRO_11.3)
PE0: STM32H755_Breakout_Schematic (Actuators-NUC-H7.243), Actuators_Schematic (BRO_12.2)
PE2: STM32H755_Breakout_Schematic (Actuators-NUC-H7.235), Actuators_Schematic (BRO_6.2)
PE3: STM32H755_Breakout_Schematic (Actuators-NUC-H7.182), Actuators_Schematic (BRO_3.1)
PE4: STM32H755_Breakout_Schematic (Actuators-NUC-H7.176), Actuators_Schematic (BRO_2.1)
PE5: STM32H755_Breakout_Schematic (Actuators-NUC-H7.178), Actuators_Schematic (BRO_2.2)
PE6: STM32H755_Breakout_Schematic (Actuators-NUC-H7.180), Actuators_Schematic (BRO_2.3)
PE7: STM32H755_Breakout_Schematic (Actuators-NUC-H7.230), Actuators_Schematic (BRO_8.1)
PE8: STM32H755_Breakout_Schematic (Actuators-NUC-H7.228), Actuators_Schematic (BRO_9.3)
PE10: STM32H755_Breakout_Schematic (Actuators-NUC-H7.234), Actuators_Schematic (BRO_8.2)
PE11: STM32H755_Breakout_Schematic (Actuators-NUC-H7.216), Actuators_Schematic (BRO_10.2)
PE12: STM32H755_Breakout_Schematic (Actuators-NUC-H7.236), Actuators_Schematic (BRO_8.3)
PE13: STM32H755_Breakout_Schematic (Actuators-NUC-H7.220), Actuators_Schematic (BRO_9.1)
PE14: STM32H755_Breakout_Schematic (Actuators-NUC-H7.218), Actuators_Schematic (BRO_10.3)
PE15: STM32H755_Breakout_Schematic (Actuators-NUC-H7.240), Actuators_Schematic (BRO_7.3)
PF7: STM32H755_Breakout_Schematic (Actuators-NUC-H7.186), Actuators_Schematic (BRO_3.3)
PF8: STM32H755_Breakout_Schematic (Actuators-NUC-H7.184), Actuators_Schematic (BRO_3.2)
PF10: STM32H755_Breakout_Schematic (Actuators-NUC-H7.219), Actuators_Schematic (BRO_4.1)
PG6: STM32H755_Breakout_Schematic (Actuators-NUC-H7.223), Actuators_Schematic (BRO_4.3)
PG8: STM32H755_Breakout_Schematic (Actuators-NUC-H7.160), Actuators_Schematic (BRO_1.3)
PG9: STM32H755_Breakout_Schematic (Actuators-NUC-H7.210), Actuators_Schematic (BRO_11.2)
PG10: STM32H755_Breakout_Schematic (Actuators-NUC-H7.158), Actuators_Schematic (BRO_1.2)
PG12: STM32H755_Breakout_Schematic (Actuators-NUC-H7.212), Actuators_Schematic (BRO_11.1)
Servo: STM32H755_Breakout_Schematic (Actuators-NUC-H7.191), Sensors_Schematic (Servo_Motor.1)
TMC_Dir: STM32H755_Breakout_Schematic (Actuators-NUC-H7.203), Sensors_Schematic (TMC1.9)
TMC_EN: STM32H755_Breakout_Schematic (Actuators-NUC-H7.154), Sensors_Schematic (TMC1.16)
TMC_Step: STM32H755_Breakout_Schematic (Actuators-NUC-H7.209), Sensors_Schematic (TMC1.10)
TMC_UART: STM32H755_Breakout_Schematic (Actuators-NUC-H7.164 R2.1), Sensors_Schematic (TMC1.12)
UWB_MISO: Actuators_Schematic (BRO15.1), Sensors_Schematic (J25.35)
UWB_MOSI: Actuators_Schematic (BRO15.2), Sensors_Schematic (J25.34)
UWB_PB13: Actuators_Schematic (BRO_13.1), Sensors_Schematic (J25.28)
UWB_PB14: Actuators_Schematic (BRO_13.2), Sensors_Schematic (J25.27)
UWB_PB15: Actuators_Schematic (BRO_13.3), Sensors_Schematic (J25.26)
UWB_SCL: Actuators_Schematic (BRO14.2), Sensors_Schematic (J25.2)
UWB_SDA: Actuators_Schematic (BRO14.1), Sensors_Schematic (J25.3)